# EAGLE design tractor_2v5 (EAGLE 9.0.1)
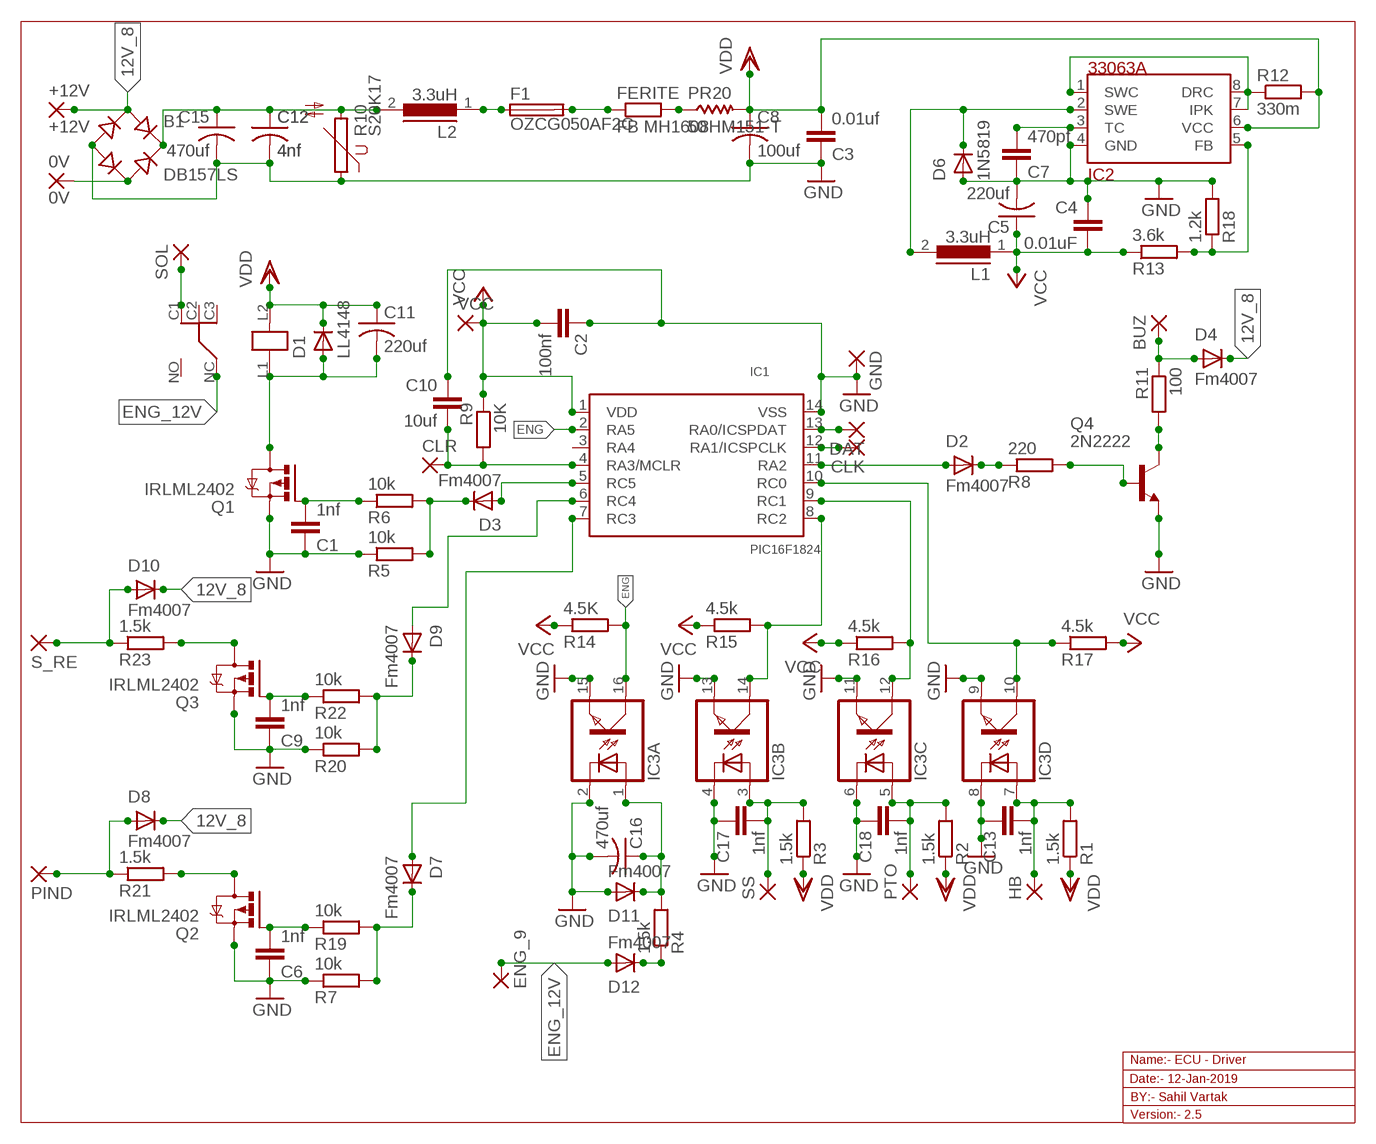
[diagram p0: schematic, sheet 1]

## Parts
0V  0V  2,54/1,1  [2,54/1,1]
+12V  +12V  2,54/1,1  [2,54/1,1]
B1  DB157LS  DBS106G  [DBS]
BUZ  2,54/1,1  [2,54/1,1]
C1  1nf  CC0603  [C0603]
C2  100nf  CC0603  [C0603]
C3  0.01uf  CC0603  [C0603]
C4  0.01uF  CC0603  [C0603]
C5  220uf  C-US025-025X050  [C025-025X050]
C6  1nf  CC0603  [C0603]
C7  470pf  CC0603  [C0603]
C8  100uf  C-US025-025X050  [C025-025X050]
C9  1nf  CC0603  [C0603]
C10  10uf  CC0603  [C0603]
C11  220uf  C-US025-025X050  [C025-025X050]
C12  4nf  C-US050-045X075  [C050-045X075]
C13  1nf  CC0603  [C0603]
C15  470uf  C-US050-075X075  [C050-075X075]
C16  470uf  C-US050-075X075  [C050-075X075]
C17  1nf  CC0603  [C0603]
C18  1nf  CC0603  [C0603]
CLK  1,6/0,8  [1,6/0,8]
CLR  1,6/0,8  [1,6/0,8]
D1  LL4148  GF1  [SMA-DO214AC]
D2  Fm4007  GF1  [SMA-DO214AC]
D3  Fm4007  GF1  [SMA-DO214AC]
D4  Fm4007  GF1  [SMA-DO214AC]
D6  1N5819  GF1  [SMA-DO214AC]
D7  Fm4007  GF1  [SMA-DO214AC]
D8  Fm4007  GF1  [SMA-DO214AC]
D9  Fm4007  GF1  [SMA-DO214AC]
D10  Fm4007  GF1  [SMA-DO214AC]
D11  Fm4007  GF1  [SMA-DO214AC]
D12  Fm4007  GF1  [SMA-DO214AC]
DAT  1,6/0,8  [1,6/0,8]
ENG_9  2,54/1,1  [2,54/1,1]
F1  OZCG050AF2C  RES_FUSE  [RES_FUSE]
FERITE  FB MH1608HM151-T  R-EU_R0603  [R0603]
GND  1,6/0,8  [1,6/0,8]
HB  2,54/1,1  [2,54/1,1]
IC1  PIC16F1824  [SO-14]
IC2  33063A  [D_R-PDSO-G8]
IC3  TLP283-4  [MINI-FLAT-16]
K2  RL3531RL3  [RL3531]
L1  3.3uH  82114R  [82114R]
L2  3.3uH  82114R  [82114R]
PIND  2,54/1,1  [2,54/1,1]
PR20  50  R-US_WSC2515  [WSC2515]
PTO  2,54/1,1  [2,54/1,1]
Q1  IRLML2402  IRLML5203  [MICRO3]
Q2  IRLML2402  IRLML5203  [MICRO3]
Q3  IRLML2402  IRLML5203  [MICRO3]
Q4  2N2222  [TO18]
R1  1.5k  RR0603  [R0603]
R2  1.5k  RR0603  [R0603]
R3  1.5k  RR0603  [R0603]
R4  1.5k  RR0603  [R0603]
R5  10k  RR0603  [R0603]
R6  10k  RR0603  [R0603]
R7  10k  RR0603  [R0603]
R8  220  RR0603  [R0603]
R9  10K  RR0603  [R0603]
R10  S20K17  S14K17  [S14K17]
R11  100  RR0603  [R0603]
R12  330m  RR2010  [R2010]
R13  3.6k  RR0603  [R0603]
R14  4.5K  RR0603  [R0603]
R15  4.5k  RR0603  [R0603]
R16  4.5k  RR0603  [R0603]
R17  4.5k  RR0603  [R0603]
R18  1.2k  RR0603  [R0603]
R19  10k  RR0603  [R0603]
R20  10k  RR0603  [R0603]
R21  1.5k  RR0603  [R0603]
R22  10k  RR0603  [R0603]
R23  1.5k  RR0603  [R0603]
S_RE  2,54/1,1  [2,54/1,1]
SOL  2,54/1,1  [2,54/1,1]
SS  2,54/1,1  [2,54/1,1]
VCC  1,6/0,8  [1,6/0,8]

## Nets
12V_8: +12V.1(P) B1.AC1 D4.K(C) D8.K(C) D10.K(C)
ENG: IC1.2(RA5) IC3.16(A:COL) R14.2
ENG_12V: D12.A ENG_9.1(P) K2.NC
GND: B1.- C1.1 C2.1 C3.1 C4.1 C5.2 C6.1 C7.1 C8.2 C9.1 C10.1 C12.2 C13.1 C15.2 C16.2 C17.1 C18.1 D6.A D11.A GND.1(P) IC1.14(VSS) IC2.4(GND) IC3.2(A:C) IC3.4(B:C) IC3.6(C:C) IC3.8(D:C) IC3.9(D:EMIT) IC3.11(C:EMIT) IC3.13(B:EMIT) IC3.15(A:EMIT) Q1.2(S) Q2.2(S) Q3.2(S) Q4.1(E) R5.1 R7.1 R10.1 R18.2 R20.1
N$1: Q4.2(B) R8.2
N$3: IC1.10(RC0) IC3.10(D:COL) R17.1
N$5: C11.2 D1.A K2.L1 Q1.3(D)
N$6: C9.2 Q3.1(G) R22.1
N$7: D2.K(C) R8.1
N$8: DAT.1(P) IC1.13(RA0/ICSPDAT)
N$9: CLK.1(P) IC1.12(RA1/ICSPCLK)
N$13: Q4.3(C) R11.2
N$15: FERITE.2 PR20.1
N$16: BUZ.1(P) D4.A R11.1
N$17: D3.A IC1.5(RC5)
N$18: IC2.1(SWC) IC2.7(IPK) IC2.8(DRC) R12.1
N$19: C7.2 IC2.3(TC)
N$20: F1.2 FERITE.1
N$21: F1.1 L2.1
N$22: D6.K(C) IC2.2(SWE) L1.2
N$23: IC2.5(FB) R13.2 R18.1
N$24: C6.2 Q2.1(G) R19.1
N$25: Q2.3(D) R21.2
N$26: D7.K(C) R7.2 R19.2
N$27: D9.A IC1.6(RC4)
N$28: D8.A PIND.1(P) R21.1
N$29: B1.+ C12.1 C15.1 L2.2 R10.2
N$30: D9.K(C) R20.2 R22.2
N$31: D7.A IC1.7(RC3)
N$32: Q3.3(D) R23.2
N$33: D10.A R23.1 S_RE.1(P)
N$34: C18.2 IC3.5(C:A) PTO.1(P) R2.2
N$36: D12.K(C) R4.1
N$37: 0V.1(P) B1.AC2
N$72: C1.2 Q1.1(G) R6.1
N$74: D3.K(C) R5.2 R6.2
N$76: C16.1 D11.K(C) IC3.1(A:A) R4.2
N$78: C17.2 IC3.3(B:A) R3.2 SS.1(P)
N$82: C13.2 HB.1(P) IC3.7(D:A) R1.2
N$84: IC1.9(RC1) IC3.12(C:COL) R16.2
N$85: IC1.8(RC2) IC3.14(B:COL) R15.2
N$87: C10.2 CLR.1(P) IC1.4(RA3/MCLR) R9.2
N$88: D2.A IC1.11(RA2)
R_3: K2.C1 SOL.1(P)
VCC: C2.2 C4.2 C5.1 IC1.1(VDD) L1.1 R9.1 R13.1 R14.1 R15.1 R16.1 R17.2 VCC.1(P)
VDD: C3.2 C8.1 C11.1 D1.K(C) IC2.6(VCC) K2.L2 PR20.2 R1.1 R2.1 R3.1 R12.2
Unconnected: IC1.3(RA4) K2.C2 K2.C3 K2.NO

## Notes on the sheet
- Name:- ECU - Driver
- Date:- 12-Jan-2019
- BY:- Sahil Vartak
- Version:- 2.5

## Library data of the parts
0V +12V BUZ ENG_9 HB PIND PTO S_RE SOL SS = wirepad:2,54/1,1: THROUGH-HOLE PAD
B1 = rectifier:DB?*G: Single Phase 1.0 AMP Glass Passivated Bridge Rectifier Taiwan Semiconductor Co.,Ltd. - TSC Source: http://www.taiwansemi.com/TSCbig5/ezcatfiles/cust/img/img/db101g.pdf http://www.ts.com.tw/db/pictures/modules/PDT/PDT060207001/DBLS201G.pdf
C1-C4 C6 C7 C9 C10 C13 C17 C18 = eagle-ltspice:C: CAPACITOR, European symbol; SPICEMODEL: NONE; SPICEPREFIX: C
C5 C8 C11 C12 = rcl:C-US: CAPACITOR, American symbol
C15 C16 = resistor:C-US: CAPACITOR, American symbol
CLK CLR DAT GND VCC = wirepad:1,6/0,8: THROUGH-HOLE PAD
D1-D4 D6-D12 = diode:GF1: DIODE
F1 = fuse:RES_FUSE
FERITE = resistor:R-EU_: RESISTOR, European symbol
IC1 = microchip:PIC16F1824
IC2 = linear:33063A
IC3 = optocoupler:TLP283-4: TOSHIBA PHOTOCOUPLER GaAs IRED & PHOTO-TRANSISTOR Source: http://www.semicon.toshiba.co.jp/td/en/Opto/Photocoupler/en_20050928_TLP283_datasheet.pdf; OC_FARNELL: unknown; OC_NEWARK: unknown
K2 = relay:RL3531
L1 L2 = inductors:82114R: INDUCTOR; SPICEPREFIX: L
PR20 = resistor:R-US_: RESISTOR, American symbol
Q1-Q3 = transistor-power:IRLML5203: HEXFET P-Channel Power MOSFET
Q4 = transistor-npn:2N2222*: NPN Transistor
R1-R9 R11-R23 = eagle-ltspice:R: RESISTOR, European symbol; SPICEMODEL: NONE; SPICEPREFIX: R
R10 = varistor:S14K17: VARISTOR

## Board
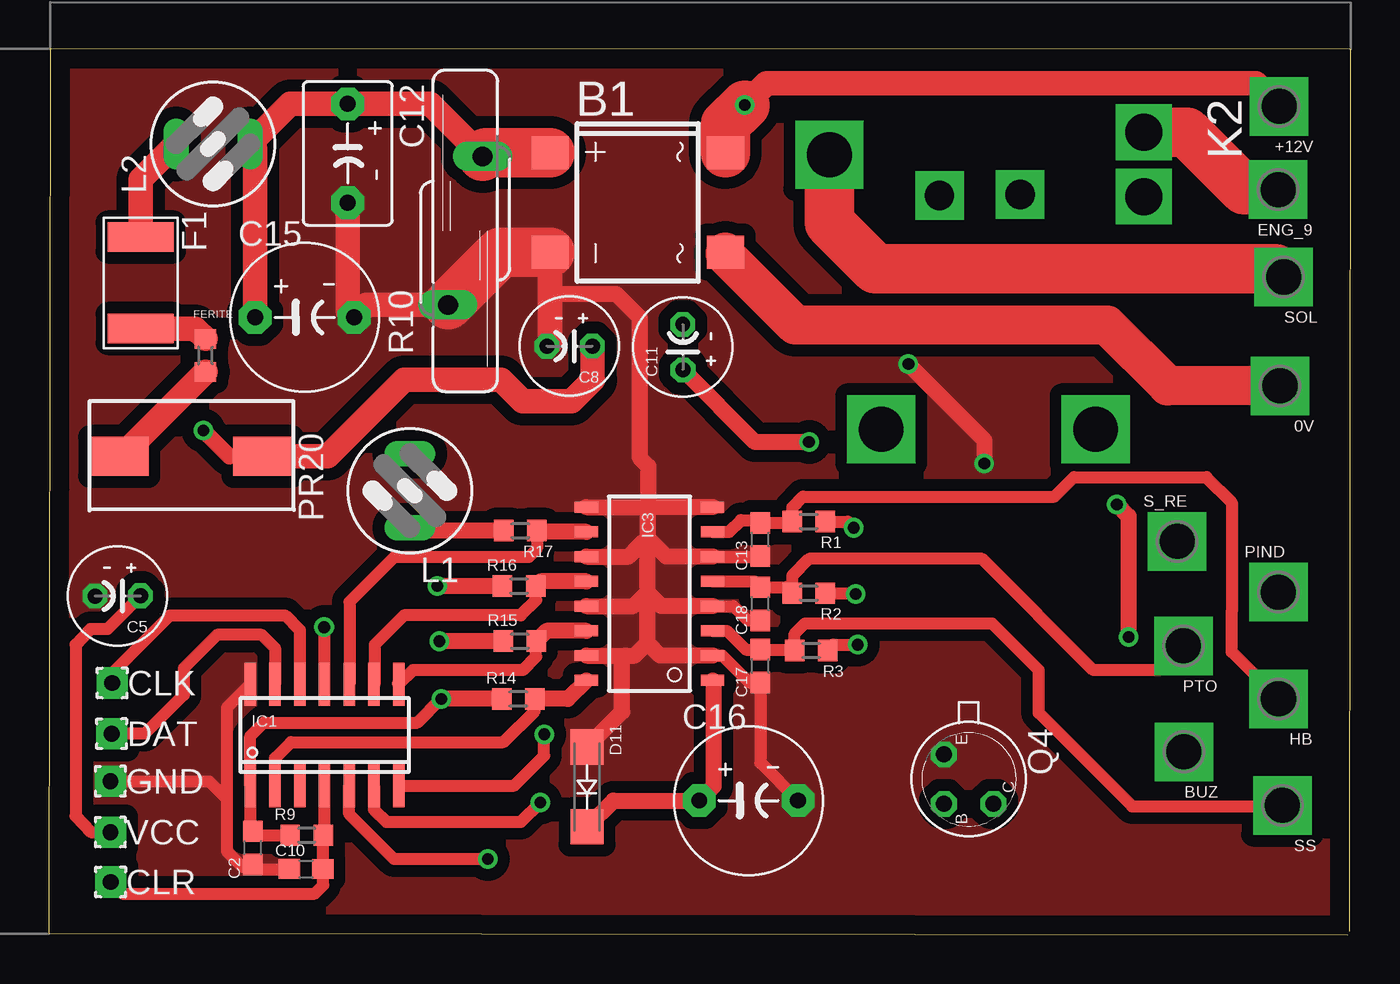
[diagram p1: board, top side]
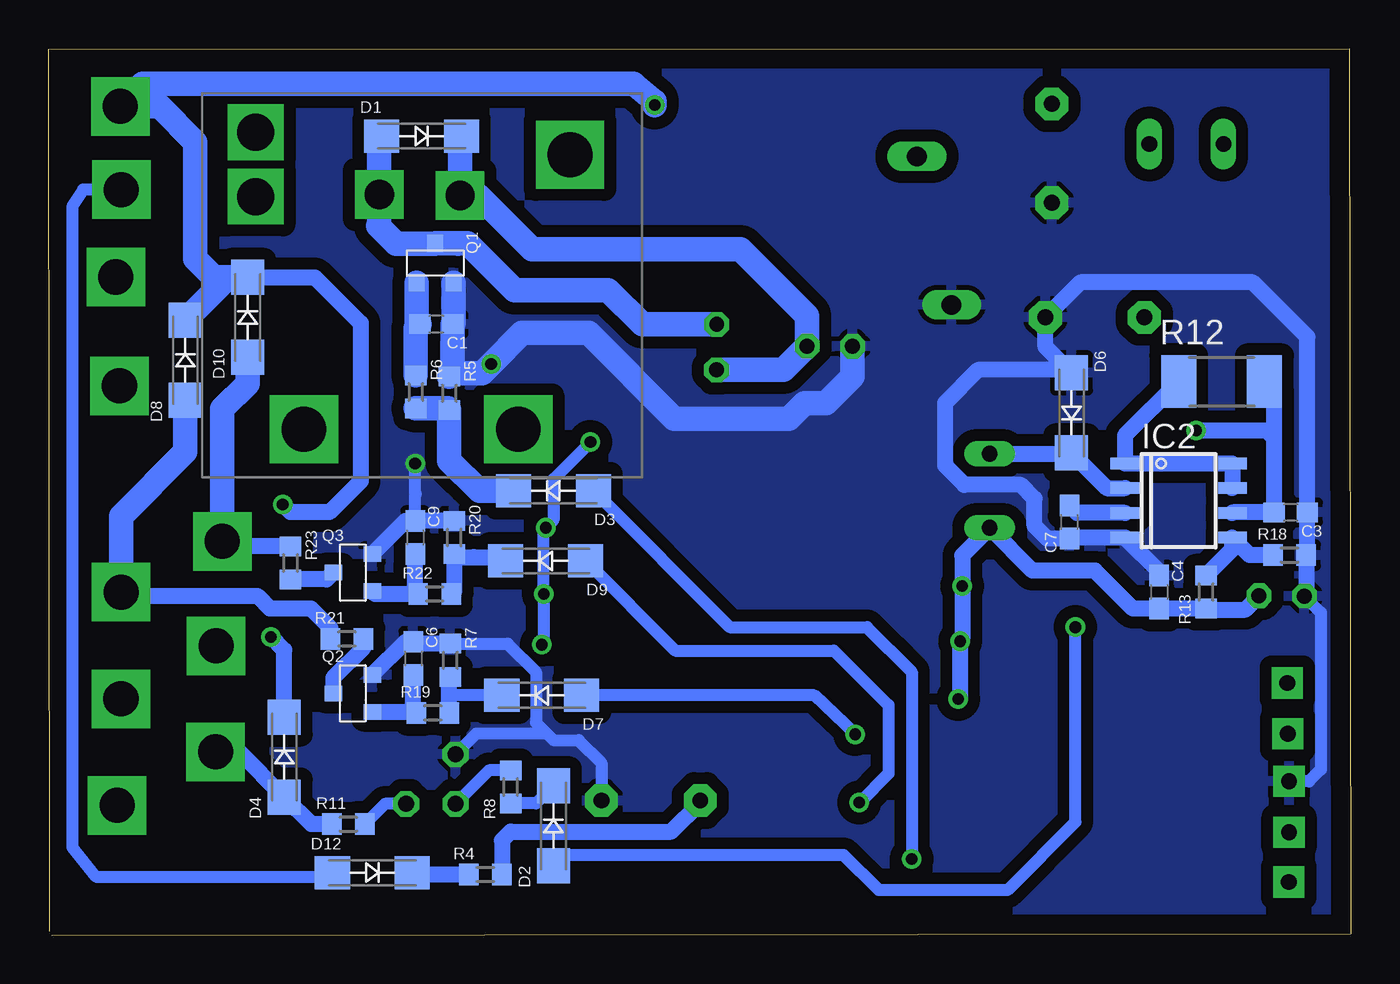
[diagram p2: board, bottom side, seen from below]

Size 66.86 x 45.49 mm. Coordinates in mm from the lower left corner, seen from the top.
Outline: 66.8,0.2 66.86,45.47 0.08,45.49 0,0.06 66.7,0
Copper layers (1*16): Top 0.035mm / dielectric 1.5mm / Bottom 0.035mm
Design rules "default": minimum track width 10mil, minimum drill 24mil, track to track 8mil, track to pad 8mil, pad to pad 8mil, via to via 8mil, smd to smd 8mil, copper to edge 40mil, drill to drill 8mil, minimum pad ring 10mil, minimum via ring 8mil, stop-mask expansion 4mil, vias tented up to drill 0mil, thermal gap 10mil

### Footprints (pad centres in the part's own frame; a part is rotated, then mirrored left to right if it is on the bottom)
2,54/1,1 = drill 1.8 pad 3 square: 1 0,0
DBS = smd 1.7 x 1.9: + -2.55,-4.5; - 2.55,-4.5; AC1 -2.55,4.5; AC2 2.55,4.5
C0603 = smd 1.1 x 1: 1 -0.85,0; 2 0.85,0
C025-025X050 = drill 0.762 pad 1.27 octagon: 1 -1.176,-0.006; 2 1.159,0.007
C050-045X075 = drill 0.813 pad 1.676 octagon: 1 -2.54,0; 2 2.54,0
C050-075X075 = drill 0.813 pad 1.676 octagon: 1 -2.54,0; 2 2.54,0
1,6/0,8 = drill 0.813 pad 1.6 square: 1 0,0
SMA-DO214AC = smd 1.8 x 1.7: A -2.05,0; K 2.05,0
RES_FUSE = smd 1.5 x 3.4: 1 -2.324,-0.11; 2 2.376,-0.11
R0603 = smd 1 x 1.1: 1 -0.85,0; 2 0.85,0
SO-14 = smd 0.6 x 2.2: 1 -3.81,-2.6; 2 -2.54,-2.6; 3 -1.27,-2.6; 4 0,-2.6; 5 1.27,-2.6; 6 2.54,-2.6; 7 3.81,-2.6; 8 3.81,2.6; 9 2.54,2.6; 10 1.27,2.6; 11 0,2.6; 12 -1.27,2.6; 13 -2.54,2.6; 14 -3.81,2.6
D_R-PDSO-G8 = smd 0.6 x 1.5: 1 -1.905,-2.75; 2 -0.635,-2.75; 3 0.635,-2.75; 4 1.905,-2.75; 5 1.905,2.75; 6 0.635,2.75; 7 -0.635,2.75; 8 -1.905,2.75
MINI-FLAT-16 = smd 1.2 x 0.56: 1 -3.24,4.445; 2 -3.24,3.175; 3 -3.24,1.905; 4 -3.24,0.635; 5 -3.24,-0.635; 6 -3.24,-1.905; 7 -3.24,-3.175; 8 -3.24,-4.445; 9 3.24,-4.445; 10 3.24,-3.175; 11 3.24,-1.905; 12 3.24,-0.635; 13 3.24,0.635; 14 3.24,1.905; 15 3.24,3.175; 16 3.24,4.445
RL3531 = drill 2.3 pad 3.5 square: C1 -7.983,-8.73; C2 6.107,4.93; C3 6.107,-6.08 | drill 1.5 pad 2.5 square: L1 -5.943,1.06; L2 -5.893,-3.08 | drill 1.9 pad 2.5 square: NC -9.143,7.41; NO -5.843,7.41
82114R = drill 0.813 long: 1 0,1.905; 2 0,-1.905
WSC2515 = smd 3 x 2: 1 -3.575,-0.1; 2 3.775,-0.1
MICRO3 = smd 0.8 x 0.9: 1 -0.95,-1; 2 0.95,-1; 3 0,1
TO18 = drill 0.813 octagon: 1 -1.27,-1.27; 2 1.27,-1.27; 3 1.27,1.27
S14K17 = drill 1.016 long: 1 -0.889,-3.81; 2 0.889,3.81
R2010 = smd 1.8 x 2.7: 1 -2.2,0; 2 2.2,0

### Placement (x,y rotation side)
0V  63.22,28.19 180 top
+12V  63.18,42.54 180 top
B1  30.24,37.6 270 top
BUZ  58.29,9.41 180 top
C1  46.96,31.36 180 bottom
C2  10.49,4.48 90 top
C3  3.08,21.69 180 bottom
C4  9.84,17.6 270 bottom
C5  3.54,17.4 180 top
C6  48.14,14.2 270 bottom
C7  14.44,21.2 90 bottom
C8  26.74,30.22 180 top
C9  48.04,20.4 270 bottom
C10  13.22,3.38 0 top
C11  32.56,30.18 90 top
C12  15.35,40.12 270 top
C13  36.54,20.3 90 top
C15  13.14,31.7 0 top
C16  35.94,6.9 0 top
C17  36.54,13.8 90 top
C18  36.54,17 90 top
CLK  3.26,12.93 270 top
CLR  3.18,2.72 270 top
D1  47.71,41.01 0 bottom
D2  40.94,5.6 90 bottom
D3  40.94,22.8 180 bottom
D4  54.76,9.13 90 bottom
D6  14.34,26.8 270 bottom
D7  41.54,12.3 180 bottom
D8  59.84,29.5 90 bottom
D9  41.34,19.2 180 bottom
D10  56.64,31.7 90 bottom
D11  27.64,7.6 270 top
D12  50.24,3.2 0 bottom
DAT  3.24,10.33 270 top
ENG_9  63.13,38.26 180 top
F1  4.84,33.5 270 top
FERITE  8.05,29.75 270 top
GND  3.17,7.89 270 top
HB  63.15,12.13 180 top
IC1  14.16,10.27 0 top
IC2  8.84,22.3 270 bottom
IC3  30.85,17.52 180 top
K2  48.82,32.06 270 top
L1  18.54,22.8 180 top
L2  8.44,40.6 90 top
PIND  63.14,17.6 0 top
PR20  7.2,24.67 0 top
PTO  58.27,14.84 180 top
Q1  47.02,34.49 0 bottom
Q2  51.24,12.4 90 bottom
Q3  51.24,18.6 90 bottom
Q4  47.24,8 270 top
R1  39.03,21.22 180 top
R2  39.03,17.54 180 top
R3  39.15,14.61 180 top
R4  44.43,3.11 0 bottom
R5  46.29,27.81 270 bottom
R6  48.01,27.88 270 bottom
R7  46.24,14.1 270 bottom
R8  43.14,7.6 90 bottom
R9  13.25,5.12 0 top
R10  21.39,36.15 0 top
R11  51.48,5.69 0 bottom
R12  6.64,28.4 0 bottom
R13  7.44,17.6 90 bottom
R14  24.11,12.12 0 top
R15  24.18,15.08 0 top
R16  24.15,17.91 0 top
R17  24.22,20.76 180 top
R18  3.14,19.5 0 bottom
R19  47.14,11.4 0 bottom
R20  46.04,20.4 270 bottom
R21  51.54,15.2 0 bottom
R22  47.04,17.5 0 bottom
R23  54.44,19.1 270 bottom
S_RE  57.94,20.2 0 top
SOL  63.41,33.78 180 top
SS  63.35,6.66 180 top
VCC  3.17,5.28 270 top

### Tracks (layer width: path | path; a pad name or v marks a point on that pad's centre or on a via)
12V_8  (via drill 0.6 pad 1)
  Top 0.813: v54.84,22.1 55.44,21.5 v55.44,15.3
  Top 1.27: 34.54,40.35 B1.AC1 | +12V.1 61.99,43.73 36.86,43.73 v35.74,42.6
  Top 2.54: B1.AC1 34.74,41.6 v35.74,42.6
  Bottom 0.813: D10.K 53.19,33.75 50.84,31.4 50.84,23.3 52.44,21.7 54.44,21.7 v54.84,22.1 | D4.K 54.76,14.62 v55.44,15.3
  Bottom 1.27: D8.K 57.64,33.75 D10.K 58.39,33.75 59.34,34.7 59.34,40.7 61.17,42.54 +12V.1 | 63.24,42.5 62.04,43.7 36.84,43.7 35.74,42.8 v35.74,42.6
ENG
  Top 0.61: IC1.2 11.62,9.09 12.44,9.9 23.34,9.9 24.96,11.53 R14.2
  Top 0.813: IC3.16 26.65,12.12 R14.2
ENG_12V
  Top 2.54: K2.NC 58.44,41.21 61.39,38.26 ENG_9.1
  Bottom 0.61: ENG_9.1 65.09,38.26 65.64,37.4 65.64,4.5 64.44,3 52.49,3 D12.A
GND  (via drill 0.6 pad 1)
  Top 0.61: IC3.6 36.51,19.43 C13.1 | IC3.4 35.16,16.89 35.89,16.15 C18.1 | IC3.2 34.6,14.35 35.99,12.95 C17.1 36.54,8.84 C16.2 | C10.1 10.74,3.38 C2.1 10.07,3.63 9.94,3.5 9.14,4.3 9.14,7 | IC1.14 9.14,11.66 9.14,7 | 48.14,24.2 v48.04,24.2 | GND.1 8.25,7.89 9.14,7
  Top 0.813: IC3.6 31.72,19.43 30.74,20.4 | 30.74,22 30.74,20.4 | IC3.11 29.76,19.43 30.39,20.05 | 30.39,20.05 30.74,20.4 | IC3.9 30.7,21.97 30.74,22 | IC3.8 30.78,21.97 | 30.78,21.97 30.74,22 | IC3.13 30.02,16.89 30.74,17.6 | 30.74,17.6 30.74,19.7 30.39,20.05 | IC3.4 31.46,16.89 31.04,17.3 | 31.04,17.3 30.74,17.6 | IC3.15 29.64,14.35 | 29.64,14.35 30.08,14.35 30.74,15 | 30.74,15 30.74,17 31.04,17.3 | IC3.2 31.4,14.35 30.74,15 | 25.74,32.9 29.14,32.9 30.34,31.7 30.34,24.5 30.78,24.07 30.78,21.97 | 29.64,14.35 29.44,14.15 29.44,11.45 D11.A | v44.14,29.3 48.04,25.4 v48.04,24.2
  Top 1.27: C12.2 15.35,32.03 C15.2 16.32,32.34 R10.1 | B1.- 25.74,32.9 25.74,30.38 C8.2
  Top 2.54: B1.- 23.21,35.05 R10.1
  Bottom 0.61: R7.1 43.29,14.95 41.84,13.5 41.84,10.9 41.29,10.35 | C9.1 48.04,22.6 48.02,22.63 48.04,22.65 v48.04,24.2 | C5.2 1.54,16.56 1.54,8.5 2.15,7.89 GND.1 | 41.29,10.35 40.94,10 39.64,10 38.48,8.84 C16.2 | Q4.1 44.89,10.35 41.29,10.35
  Bottom 0.813: Q2.2 48.54,15.05 C6.1 48.04,14.95 R7.1 | Q3.2 48.54,21.25 C9.1 R20.1 | C4.1 9.84,18.65 IC2.4 14.39,20.4 C7.1 15.59,20.35 16.24,21 16.24,22.4 16.94,23.1 19.84,23.1 20.84,24.1 20.84,27.3 19.14,29 14.49,29 D6.A 15.68,30.19 C15.2 13.88,33.5 5.04,33.5 2.23,30.7 C3.1 2.23,19.56 R18.2 2.29,17.49 C5.2
  Bottom 1.27: C8.2 25.58,28.66 26.94,27.3 28.04,27.3 28.84,26.5 34.74,26.5 39.14,30.9 42.54,30.9 v44.14,29.3 44.6,28.84 46.11,28.84 | Q1.2 46.07,31.4 C1.1 46.11,28.84 | 46.11,28.84 R5.1
  pour Top (isolate 0.61, no thermals): -0.46,45.4 66.94,45.6 66.94,-0.2 -0.46,-0.4
  pour Bottom (isolate 0.61): -0.46,45.4 66.94,45.6 66.94,-0.2 -0.36,-0.4
N$1
  Bottom 0.61: R8.2 44.25,8.45 Q4.2
N$3
  Top 0.61: R17.1 25.07,19.83 24.64,19.4 17.74,19.4 15.44,17.1 IC1.10
  Top 0.813: IC3.10 25.13,20.7 R17.1
N$5
  Bottom 1.27: 45.81,35.5 45.34,35.5 42.94,33.1 38.14,33.1 36.38,31.34 C11.2 | 45.81,35.5 45.82,35.49 | D1.A 49.88,40.89 K2.L1 49.88,36.46 49.94,36.4 49.02,35.49 Q1.3 47,35.5 45.81,35.5
N$6
  Bottom 0.813: C9.2 48.04,17.65 R22.1 50.09,17.5 Q3.1
N$7
  Bottom 0.61: D2.K 41.84,6.75 R8.1
  Bottom 0.813: 41.14,7.85 D2.K
N$8
  Top 0.61: IC1.13 11.62,14.72 10.94,15.4 8.64,15.4 6.94,13.7 6.94,12.33 4.94,10.33 DAT.1
N$9
  Top 0.61: IC1.12 12.89,15.65 12.14,16.4 6.23,16.4 3.26,13.43 CLK.1
N$13
  Bottom 0.61: Q4.3 49.58,6.73 R11.2
N$15
  Top 1.27: FERITE.2 7.39,28.25 3.72,24.57 PR20.1
N$16
  Bottom 0.813: R11.1 53.37,5.69 D4.A 57.08,9.41 BUZ.1
N$17  (via drill 0.6)
  Top 0.61: IC1.5 15.43,6.21 17.74,3.9 v22.54,3.9
  Bottom 0.61: D3.A 31.89,15.8 24.84,15.8 22.54,13.5 v22.54,3.9
N$18
  Bottom 0.813: IC2.7 IC2.8 IC2.1 11.59,25.65 R12.1
N$19
  Bottom 0.813: IC2.3 14.05,21.67 C7.2
N$20
  Top 1.27: F1.2 7.53,31.13 FERITE.1
N$21
  Top 1.27: L2.1 4.73,38.8 F1.1
N$22
  Bottom 0.813: IC2.2 12.53,22.94 D6.K 14.38,24.71 L1.2
N$23
  Bottom 0.813: R18.1 5.2,19.5 IC2.5 6.09,19.8 R13.2
N$24
  Bottom 0.813: C6.2 48.14,11.55 R19.1 48.04,11.45 Q2.1
N$25
  Bottom 0.813: R21.2 50.69,14.75 52.24,13.2 Q2.3
N$26
  Bottom 0.61: D7.K 46.29,12.3
  Bottom 0.813: R19.2 46.29,12.3 46.29,13.2 R7.2 46.19,13.2
N$27  (via drill 0.6 pad 1)
  Top 0.61: IC1.6 16.7,6.44 17.34,5.8 24.24,5.8 v25.24,6.8
  Bottom 0.61: D9.A 34.69,14.6 26.54,14.6 23.74,11.8 23.74,8.3 v25.24,6.8
N$28
  Bottom 0.813: R21.1 52.39,15.75 53.39,16.75 55.49,16.75 56.14,17.4 62.94,17.4 PIND.1
  Bottom 1.27: D8.A 59.84,24.8 63.14,21.5 PIND.1
N$29
  Top 1.27: B1.+ 25.55,39.96 | R10.2 19.58,42.66 C12.1 12.4,42.66 L2.2 10.6,40.35 C15.1
  Top 2.54: B1.+ 22.47,40.15 R10.2
N$30
  Bottom 0.813: R22.2 46.04,17.65 R20.2 45.89,19.4 45.04,19.4 43.59,19.4 D9.K
N$31  (via drill 0.6 pad 1)
  Top 0.61: IC1.7 23.91,7.67 25.44,9.2 v25.44,10.3
  Bottom 0.61: D7.A 27.54,12.3 v25.44,10.3
N$32
  Bottom 0.813: Q3.3 52.59,18.25 R23.2
N$33
  Bottom 0.813: R23.1 57.69,19.95 S_RE.1
  Bottom 1.27: D10.A 56.64,28.3 57.94,27 S_RE.1
N$34
  Top 0.61: IC3.5 36.24,18.16 C18.2 37.87,17.85 R2.2 38.18,18.44 39.04,19.3 47.94,19.3 53.64,13.6 57.03,13.6 PTO.1
N$36
  Bottom 0.813: R4.1 48.09,3.11 D12.K
N$37
  Top 2: 0V.1 57.45,28.19 54.34,31.3 38.34,31.3 34.74,34.9 B1.AC2
N$72
  Bottom 1.27: Q1.1 47.97,31.52 C1.2 48.01,31.16 R6.1
N$74
  Bottom 1.27: D3.K 44.74,22.8 46.29,24.35 R5.2 46.36,27.03 R6.2
N$76
  Top 0.813: IC3.1 34.14,13.02 34.14,7.64 C16.1 28.99,6.9 D11.K
  Bottom 0.813: R4.2 43.58,4.86 43.14,5.3 34.9,5.3 33.4,6.8 C16.1
N$78
  Top 0.61: IC3.3 34.83,15.62 35.79,14.65 C17.2 38.25,14.65 R3.2 38.29,15.46 38.84,16 48.44,16 50.84,13.6 50.84,11.4 55.64,6.6 63.3,6.6 SS.1
N$82
  Top 0.61: IC3.7 34.93,20.7 35.54,21.3 36.39,21.3 C13.2 38.11,21.15 R1.2 38.18,21.95 38.74,22.5 51.64,22.5 52.64,23.5 59.44,23.5 60.74,22.2 60.74,16.6 60.74,14.53 HB.1
N$84
  Top 0.61: R16.2 25,17.24 25.04,17.2 24.24,16.4 18.24,16.4 16.74,14.9 16.74,12.91 IC1.9
  Top 0.813: IC3.12 25.25,18.16 R16.2
N$85
  Top 0.61: R15.2 25.03,14.3 24.34,13.6 18.71,13.6 IC1.8 17.94,12.9
  Top 0.813: IC3.14 25.57,15.62 R15.2
N$87
  Top 0.61: IC1.4 14.16,5.19 R9.2 14.1,3.41 | C10.2 14.1,3.41 | 14.1,3.41 14.1,2.56 13.66,2.12 3.78,2.12 CLR.1
N$88  (via drill 0.6)
  Top 0.61: IC1.11 14.16,15.78 v14.14,15.8
  Bottom 0.61: v14.14,15.8 14.14,5.8 17.64,2.3 24.24,2.3 26.04,4.1 40.39,4.1 D2.A
R_3
  Top 2.54: K2.C1 40.09,36.55 42.44,34.2 56.84,34.2 62.98,34.2 SOL.1
VCC  (via drill 0.6 pad 1)
  Top 0.61: v20.16,12.12 18.94,10.9 11.04,10.9 10.35,10.22 IC1.1 10.35,5.47 C2.2 10.7,5.12 R9.1 | C5.1 3.01,15.7 2.14,15.7 1.38,14.9 1.38,6.1 2.16,5.28 VCC.1
  Top 0.813: R17.2 18.68,20.76 L1.1 | R16.1 v19.95,17.91 v19.94,17.9 | R15.1 v20.06,15.08 | R14.1 v20.16,12.12 20.14,12.1
  Bottom 0.813: C5.1 5.42,16.71 7.4,16.71 R13.1 C4.2 11.19,16.75 13.14,18.7 16.35,18.7 L1.1 19.95,19.49 v19.95,17.91 19.95,15.2 v20.06,15.08 20.06,12.22 v20.16,12.12
VDD  (via drill 0.6 pad 1)
  Top 0.61: R1.1 41.02,21.22 v41.34,20.9 | R2.1 41.3,17.54 v41.44,17.5 | R3.1 40.29,14.9 v41.54,14.9
  Top 0.813: PR20.2 9.27,24.57 v7.94,25.9 | v39.04,25.3 36.27,25.3 C11.1
  Top 1.27: PR20.2 14.31,24.57 18.24,28.5 23.24,28.5 24.34,27.4 26.84,27.4 27.94,28.5 27.92,28.53 C8.1
  Bottom 0.61: v41.54,14.9 41.44,15 v41.44,17.5 41.44,20.8 v41.34,20.9 40.94,21.3 40.94,23.4 v39.04,25.3
  Bottom 0.813: IC2.6 6.07,21.69 C3.2 3.93,25.5 | R12.2 3.93,27.9 3.93,25.5 | v7.94,25.9 4.33,25.9 3.93,25.5
  Bottom 1.27: D1.K 45.74,40.93 K2.L2 44.79,37.96 42.04,35.2 31.34,35.2 27.92,31.78 C8.1 29.14,29.01 C11.1